# EAGLE schematic CAN Star (EAGLE 9.5.2)
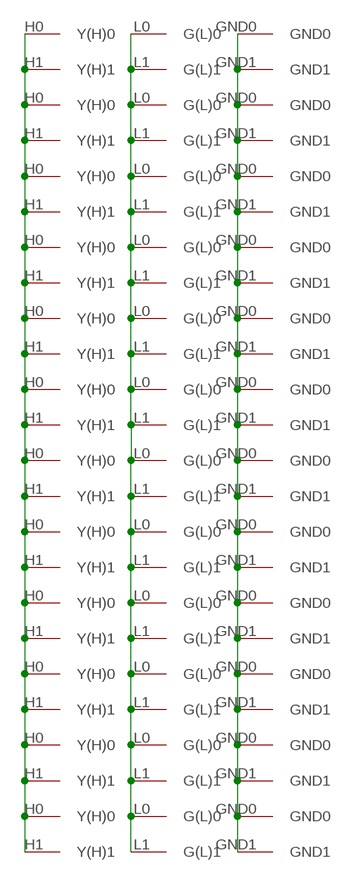
[diagram p0: schematic, sheet 1]

## Parts
U$1  2-3-TERMS  [GREEN-2-TERMS]
U$2  2-3-TERMS  [GREEN-2-TERMS]
U$3  2-3-TERMS  [GREEN-2-TERMS]
U$4  2-3-TERMS  [GREEN-2-TERMS]
U$5  2-3-TERMS  [GREEN-2-TERMS]
U$6  2-3-TERMS  [GREEN-2-TERMS]
U$7  2-3-TERMS  [GREEN-2-TERMS]
U$8  2-3-TERMS  [GREEN-2-TERMS]
U$9  2-3-TERMS  [GREEN-2-TERMS]
U$10  2-3-TERMS  [GREEN-2-TERMS]
U$11  2-3-TERMS  [GREEN-2-TERMS]
U$12  2-3-TERMS  [GREEN-2-TERMS]

## Nets
G(L): U$1.L0(G(L)0) U$1.L1(G(L)1) U$2.L0(G(L)0) U$2.L1(G(L)1) U$3.L0(G(L)0) U$3.L1(G(L)1) U$4.L0(G(L)0) U$4.L1(G(L)1) U$5.L0(G(L)0) U$5.L1(G(L)1) U$6.L0(G(L)0) U$6.L1(G(L)1) U$7.L0(G(L)0) U$7.L1(G(L)1) U$8.L0(G(L)0) U$8.L1(G(L)1) U$9.L0(G(L)0) U$9.L1(G(L)1) U$10.L0(G(L)0) U$10.L1(G(L)1) U$11.L0(G(L)0) U$11.L1(G(L)1) U$12.L0(G(L)0) U$12.L1(G(L)1)
GND [GND]: U$1.GND0 U$1.GND1 U$2.GND0 U$2.GND1 U$3.GND0 U$3.GND1 U$4.GND0 U$4.GND1 U$5.GND0 U$5.GND1 U$6.GND0 U$6.GND1 U$7.GND0 U$7.GND1 U$8.GND0 U$8.GND1 U$9.GND0 U$9.GND1 U$10.GND0 U$10.GND1 U$11.GND0 U$11.GND1 U$12.GND0 U$12.GND1
Y(H): U$1.H0(Y(H)0) U$1.H1(Y(H)1) U$2.H0(Y(H)0) U$2.H1(Y(H)1) U$3.H0(Y(H)0) U$3.H1(Y(H)1) U$4.H0(Y(H)0) U$4.H1(Y(H)1) U$5.H0(Y(H)0) U$5.H1(Y(H)1) U$6.H0(Y(H)0) U$6.H1(Y(H)1) U$7.H0(Y(H)0) U$7.H1(Y(H)1) U$8.H0(Y(H)0) U$8.H1(Y(H)1) U$9.H0(Y(H)0) U$9.H1(Y(H)1) U$10.H0(Y(H)0) U$10.H1(Y(H)1) U$11.H0(Y(H)0) U$11.H1(Y(H)1) U$12.H0(Y(H)0) U$12.H1(Y(H)1)

## Library data of the parts
U$1-U$12 = custom:2-3-TERMS

## Net classes
0 default: width 0.051 mm, drill 0.102 mm, clearance 0.051 mm
1 GND: width 0.076 mm, drill 0.102 mm, clearance 0.076 mm